# Altium schematic sheet Control.SchDoc: Control logic
size Letter; DrawnBy: J.-F. Cliche & Adam Gilbert; Engineer: J.-F. Cliche; DocumentNumber: 5; Revision: Rev2; SheetNumber: 5; SheetTotal: 5; ProjectTitle: DAN Squid Controller
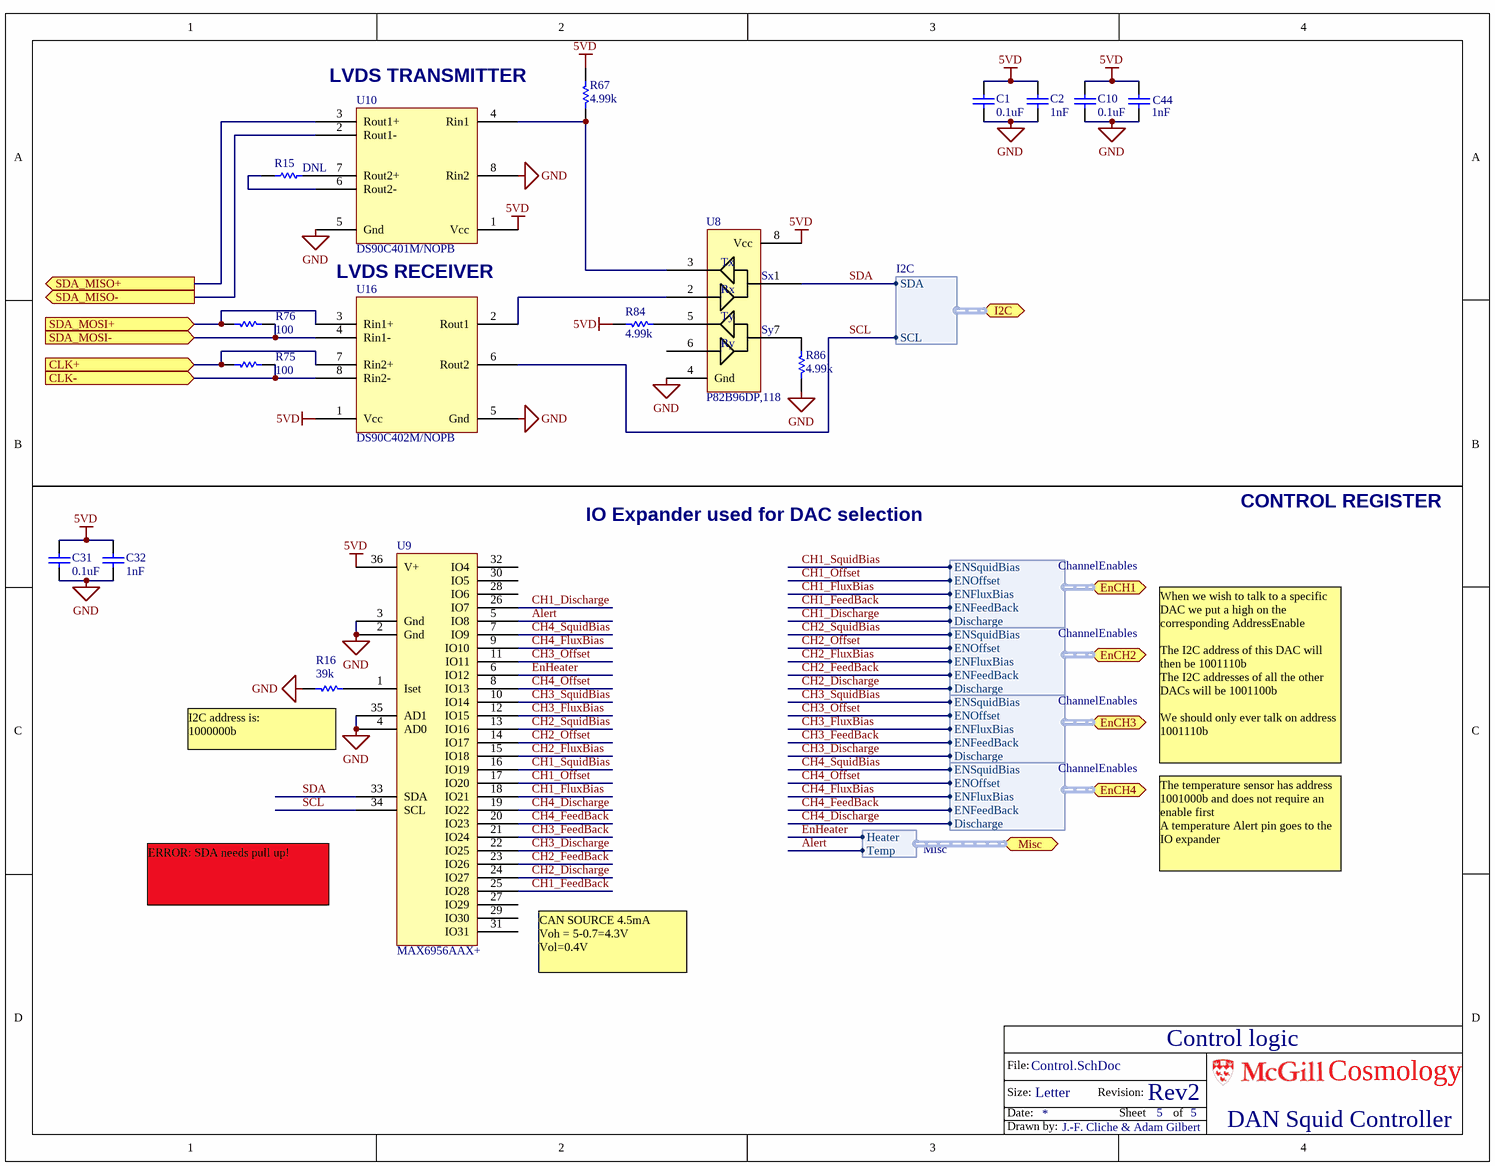
[diagram p0: Control.SchDoc]

## Parts
C1  0.1uF  [0603]
C2  1nF  [0603]
C10  0.1uF  [0603]
C31  0.1uF  [0603]
C32  1nF  [0603]
C44  1nF  [0603]
R15  DNL  [0603]
R16  39k
R67  4.99k  [0603]
R75  100  [0603]
R76  100  [0603]
R84  4.99k  [0603]
R86  4.99k  [0603]
U8  P82B96DP,118  [MSOP8-P82B96]
U9  MAX6956AAX+  [SOP36Body15.4mmx7.5mm]
U10  DS90C401M/NOPB  [SO8]
U16  DS90C402M/NOPB  [SO8]

## Ports
CLK+ (in), CLK- (in), EnCH1 (harness ChannelEnables), EnCH2 (harness ChannelEnables), EnCH3 (harness ChannelEnables), EnCH4 (harness ChannelEnables), I2C (harness I2C), Misc (harness Misc), SDA_MISO+ (out), SDA_MISO- (out), SDA_MOSI+ (in), SDA_MOSI- (in)

## Harnesses
I2C: SDA, SCL
ChannelEnables: ENSquidBias, ENOffset, ENFluxBias, ENFeedBack, Discharge
Misc: Heater, Temp

## Nets
5VD: C1.2 C2.2 C10.2 C31.2 C32.2 C44.2 R67.2 R84.2 U8.8(Vcc) U9.36(V+) U10.1(Vcc) U16.1(Vcc)
GND: C1.1 C2.1 C10.1 C31.1 C32.1 C44.1 R16.2 R86.1 U8.4(Gnd) U9.2(Gnd) U9.3(Gnd) U9.4(AD0) U9.35(AD1) U10.5(Gnd) U10.8(Rin2) U16.5(Gnd)
Alert: U9.5(IO8) ; port Misc.Temp
CH1_Discharge: U9.26(IO7) ; port EnCH1.Discharge
CH1_FeedBack: U9.25(IO28) ; port EnCH1.ENFeedBack
CH1_FluxBias: U9.18(IO21) ; port EnCH1.ENFluxBias
CH1_Offset: U9.17(IO20) ; port EnCH1.ENOffset
CH1_SquidBias: U9.16(IO19) ; port EnCH1.ENSquidBias
CH2_Discharge: U9.24(IO27) ; port EnCH2.Discharge
CH2_FeedBack: U9.23(IO26) ; port EnCH2.ENFeedBack
CH2_FluxBias: U9.15(IO18) ; port EnCH2.ENFluxBias
CH2_Offset: U9.14(IO17) ; port EnCH2.ENOffset
CH2_SquidBias: U9.13(IO16) ; port EnCH2.ENSquidBias
CH3_Discharge: U9.22(IO25) ; port EnCH3.Discharge
CH3_FeedBack: U9.21(IO24) ; port EnCH3.ENFeedBack
CH3_FluxBias: U9.12(IO15) ; port EnCH3.ENFluxBias
CH3_Offset: U9.11(IO11) ; port EnCH3.ENOffset
CH3_SquidBias: U9.10(IO14) ; port EnCH3.ENSquidBias
CH4_Discharge: U9.19(IO22) ; port EnCH4.Discharge
CH4_FeedBack: U9.20(IO23) ; port EnCH4.ENFeedBack
CH4_FluxBias: U9.9(IO10) ; port EnCH4.ENFluxBias
CH4_Offset: U9.8(IO13) ; port EnCH4.ENOffset
CH4_SquidBias: U9.7(IO9) ; port EnCH4.ENSquidBias
CLK+: R75.2 U16.7(Rin2+) ; port CLK+
CLK-: R75.1 U16.8(Rin2-) ; port CLK-
EnHeater: U9.6(IO12) ; port Misc.Heater
SCL: U9.34(SCL) U16.6(Rout2) ; port I2C.SCL
SDA: U8.1(Sx) U9.33(SDA) ; port I2C.SDA
SDA_MISO+: U10.3(Rout1+) ; port SDA_MISO+
SDA_MISO-: U10.2(Rout1-) ; port SDA_MISO-
SDA_MOSI+: R76.2 U16.3(Rin1+) ; port SDA_MOSI+
SDA_MOSI-: R76.1 U16.4(Rin1-) ; port SDA_MOSI-
NetR15_1: R15.1 U10.6(Rout2-)
NetR15_2: R15.2 U10.7(Rout2+)
NetR16_1: R16.1 U9.1(Iset)
NetR67_1: R67.1 U8.3(Tx) U10.4(Rin1)
NetR84_1: R84.1 U8.5(Ty)
NetR86_2: R86.2 U8.7(Sy)
NetU8_2: U8.2(Rx) U16.2(Rout1)

Not connected (* = marked no-connect by the designer): U8 6(Ry); U9 27(IO29) 28(IO6) 29(IO30) 30(IO5) 31(IO31) 32(IO4)

## Notes on the sheet
- (near U10) LVDS TRANSMITTER
- LVDS RECEIVER
- CONTROL REGISTER
- IO Expander used for DAC selection
- (near R16) I2C address is:
  1000000b
- When we wish to talk to a specific DAC we put a high on the corresponding AddressEnable
  The I2C address of this DAC will then be 1001110b
  The I2C addresses of all the other DACs will be 1001100b
  We should only ever talk on address 1001110b
- ERROR: SDA needs pull up!
- The temperature sensor has address 1001000b and does not require an enable first
  A temperature Alert pin goes to the IO expander
- CAN SOURCE 4.5mA
  Voh = 5-0.7=4.3V
  Vol=0.4V
- Labels drawn without touching a wire or pin: SCL
- File:
- Size:
- Date:
- Letter
- Revision:
- Sheet
- of
- Cosmology
- Drawn by:

## Library data of the parts
C1 C10 C31 = Cap0603: Capacitor, Ceramic, 0603; Part Constraints: 0.1uF 16V 10% X7R; Manufacturer: Generic; Supplier 1: Digi-Key; Supplier Part Number 1: 399-1096-1-ND; Value: 0.1uF
C2 C32 C44 = Cap0603: Capacitor, Ceramic, 0603; Part Constraints: 1nF 50V 10% X7R 0603; Manufacturer: Generic; Value: 1nF; Supplier 1: Digi-Key; Supplier Part Number 1: 399-1082-1-ND
R15 = Res0603: RES 0603; Manufacturer: Generic; Manufacturer Part Number 1: e.g CRCW0603 series; Value: DNL; Part constraints: DNL
R16 = RES 0603: Manufacturer: Generic; Manufacturer Part Number 1: CRCW060339K0FKEA; Part constraints: RES 100 OHM 1/10W 1% 0603 SMD; Manufacturer 1: Vishay Dale; Description 1: RES 39.0K OHM 1/10W 1% 0603 SMD; Category 1: Resistors; Power (Watts): 0.1W, 1/10W; Temperature Coefficient: ±100ppm/°C; Tolerance: ±1%; Footprint: 0603; Value: 39k; Supplier 1: Digi-Key; Supplier Part Number 1: 541-39.0KHCT-ND; RoHS 1: RoHS Compliant; Stock 1: 44932; Pricing 1: 10=0.096, 50=0.0516, 200=0.02965, 1000=0.02023 (CAD); Resistance (Ohms): 39k; Composition: Thick Film; Features: Automotive AEC-Q200 Qualified; Package / Case: 0603 (1608 Metric); Supplier Device Package: 0603 (1608 Metric); Size / Dimension: 0.061" L x 0.033" W (1.55mm x 0.85mm); Height: 0.020" (0.50mm); Number of Terminations: 2; Packaging: Cut Tape (CT); ComponentLink1URL: http://www.vishay.com/doc?20035; ComponentLink1Description: http://www.vishay.com/doc?20035
R67 R84 R86 = Res0603: RES 0603; Manufacturer: Generic; Part constraints: RES 4.99K OHM 1/10W 1% 0603 SMD; Manufacturer Part Number 1: e.g CRCW0603 series; Value: 4.99k; Supplier 1: Digi-Key; Supplier Part Number 1: 541-4.99KHCT-ND
R75 R76 = RES 0603: Manufacturer: Generic; Manufacturer Part Number 1: e.g CRCW0603 series; Part constraints: RES 100 OHM 1/10W 1% 0603 SMD; Value: 100; Supplier 1: Digi-Key; Supplier Part Number 1: 541-100HCT-ND
U8 = P82B96: IC DUAL BI-DIR BUS BUFFER 8-TSSOP; Manufacturer 1: NXP Semiconductors; Description 1: IC DUAL BUS BUFF 8-TSSOP; Category 1: Integrated Circuits (ICs); Tx/Rx Type: I²C Logic; Delay Time: 5.0ns; Capacitance - Input: 7pF; Voltage - Supply: 2 V ~ 15 V; Current - Supply: 900µA; Supplier 1: Digi-Key; Manufacturer Part Number 1: P82B96DP,118; RoHS 1: RoHS Compliant; Stock 1: 6660; Pricing 1: 1=3.55, 10=3.18, 25=2.8588, 100=2.6001, 250=2.35368, 500=2.1072, 1000=1.77448 (CAD); Type: Buffer; Mounting Type: Surface Mount; Package / Case: 8-TSSOP, 8-MSOP (0.118", 3.00mm Width); Supplier Device Package: 8-TSSOP; Packaging: Cut Tape (CT); ComponentLink1URL: http://www.nxp.com/documents/data_sheet/P82B96.pdf; ComponentLink1Description: http://www.nxp.com/documents/data_sheet/P82B96.pdf; Supplier Part Number 1: 568-3197-1-ND
U9 = MAX6956AAX+: IO expander 28 IOs, I2C; Manufacturer 1: Maxim Integrated; Description 1: IC DRVR DSPL LED 36-SSOP; Category 1: Integrated Circuits (ICs); Display Type: LED; Interface: I²C; Current - Supply: 180µA; Voltage - Supply: 2.5 V ~ 5.5 V; Supplier 1: Digi-Key; Manufacturer Part Number 1: MAX6956AAX+; RoHS 1: RoHS Compliant; Stock 1: 19255; Pricing 1: 1=10.64, 25=7.4604, 100=5.4065, 500=4.75594 (CAD); Configuration: -; Digits or Characters: -; Operating Temperature: -40°C ~ 125°C; Mounting Type: Surface Mount; Package / Case: 36-BSOP (0.295", 7.50mm Width); Supplier Device Package: 36-SSOP; Packaging: Tube; ComponentLink1URL: http://datasheets.maximintegrated.com/en/ds/MAX6956.pdf; ComponentLink1Description: http://datasheets.maximintegrated.com/en/ds/MAX6956.pdf; Supplier Part Number 1: MAX6956AAX+-ND
U10 = DS90C401M/NOPB: IC DRV LVDS DUAL DIFF SGNL 8SOIC; Manufacturer 1: Texas Instruments; Manufacturer Part Number 1: DS90C401MX/NOPB; Description 1: IC DVR SIGNALING DUAL DIFF 8SOIC; Category 1: Integrated Circuits (ICs); Number of Drivers/Receivers: 2/0; Voltage - Supply: 4.5 V ~ 5.5 V; Supplier 1: Digi-Key; RoHS 1: RoHS Compliant; Stock 1: 2289; Pricing 1: 1=3.37, 10=3.044, 25=2.7264, 100=2.4519, 250=2.17716, 500=1.90238, 1000=1.57474 (CAD); Type: Driver; Protocol: LVDS; Mounting Type: Surface Mount; Package / Case: 8-SOIC (0.154", 3.90mm Width); Supplier Device Package: *; Packaging: Cut Tape (CT); ComponentLink1URL: http://www.ti.com/lit/ds/symlink/ds90c401.pdf; ComponentLink1Description: http://www.ti.com/lit/ds/symlink/ds90c401.pdf; Supplier Part Number 1: 296-35380-1-ND
U16 = DS90C402M/NOPB: IC REC LVDS DUAL DIFF SGNL 8SOIC; Manufacturer 1: Texas Instruments; Manufacturer Part Number 1: DS90C402MX/NOPB; Description 1: IC RVR SIGNALING DUAL DIFF 8SOIC; Category 1: Integrated Circuits (ICs); Number of Drivers/Receivers: 0/2; Voltage - Supply: 4.5 V ~ 5.5 V; Supplier 1: Digi-Key; RoHS 1: RoHS Compliant; Stock 1: 2460; Pricing 1: 1=3.3, 10=2.95, 25=2.6528, 100=2.4127, 250=2.18404, 500=1.95532, 1000=1.64659 (CAD); Type: Receiver; Protocol: LVDS; Mounting Type: Surface Mount; Package / Case: 8-SOIC (0.154", 3.90mm Width); Supplier Device Package: *; Packaging: Cut Tape (CT); ComponentLink1URL: http://www.ti.com/lit/ds/symlink/ds90c402.pdf; ComponentLink1Description: http://www.ti.com/lit/ds/symlink/ds90c402.pdf; Supplier Part Number 1: 296-35381-1-ND